# EasyEDA Pro project grandPA2.eprj, schematic matrix
Board Name: matrix; Create Date: 2026-07-15; Page Name: P1; Project Name: grandPA2; Schematic Name: matrix; Update Date: 2026-07-21; Company: EasyEDA.com; Page Size: A4; Version: v0.2
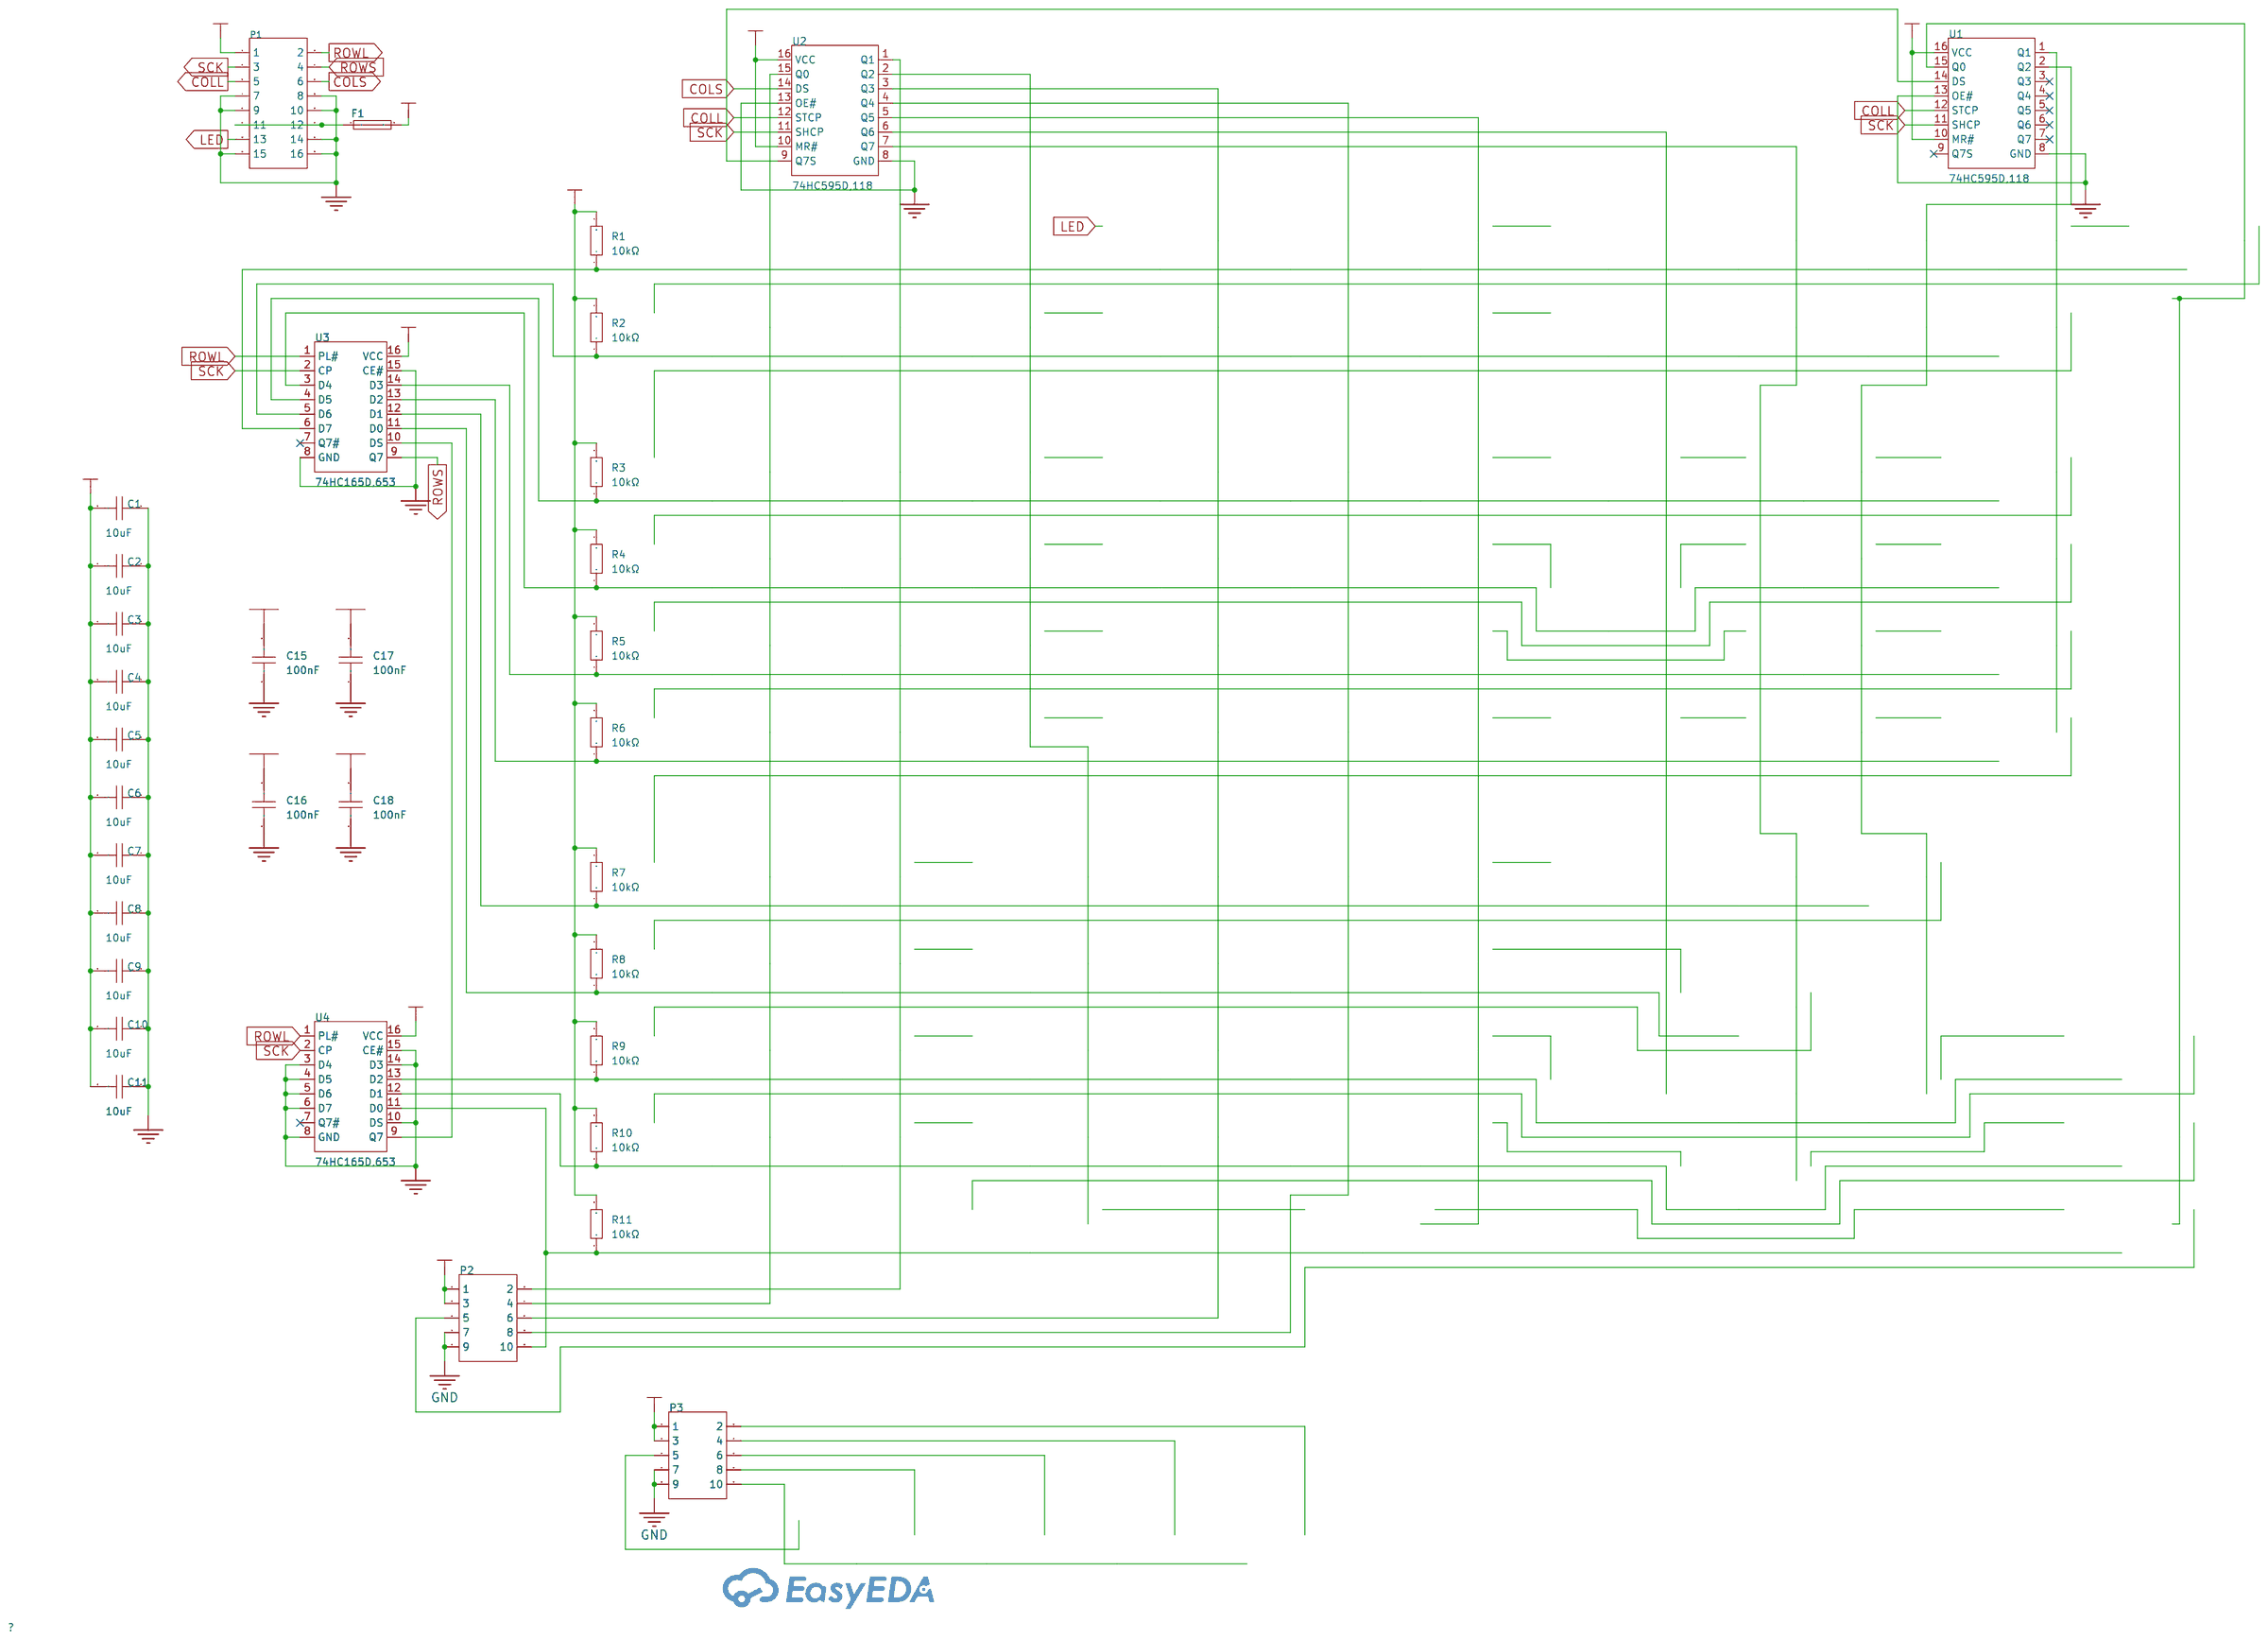
[diagram p0: schematic sheet]

## Parts
C1  10uF  [C0805]
C2  10uF  [C0805]
C3  10uF  [C0805]
C4  10uF  [C0805]
C5  10uF  [C0805]
C6  10uF  [C0805]
C7  10uF  [C0805]
C8  10uF  [C0805]
C9  10uF  [C0805]
C10  10uF  [C0805]
C11  10uF  [C0805]
C15  100nF  [C0402]
C16  100nF  [C0402]
C17  100nF  [C0402]
C18  100nF  [C0402]
CBB1  -
CBB2  -
CBB3  -
CBB4  -
CBB5  -
CBB6  -
CBB7  -
CBB8  -
CBB9  -
CBB10  -
CBB11  -
CBB12  -
CBB13  -
CBB14  -
CBB15  -
CBB16  -
CBB17  -
CBB18  -
CBB19  -
CBB20  -
CBB21  -
CBB22  -
CBB23  -
CBB24  -
CBB25  -
CBB26  -
CBB27  -
CBB28  -
CBB29  -
CBB30  -
CBB31  -
CBB32  -
CBB33  -
CBB34  -
CBB35  -
CBB36  -
CBB37  -
CBB38  -
CBB39  -
CBB40  -
CBB41  -
CBB42  -
CBB43  -
CBB44  -
CBB45  -
CBB46  -
CBB47  -
CBB48  -
CBB49  -
CBB50  -
CBB51  -
CBB52  -
CBB53  -
CBB54  -
CBB55  -
CBB56  -
CBB57  -
CBB58  -
CBB59  -
CBB60  -
CBB61  -
CBB62  -
CBB63  -
CBB64  -
CBB65  -
CBB66  -
CBB67  -
CBB68  -
CBB69  -
CBB70  -
CBB71  -
CBB72  -
CBB73  -
CBB74  -
CBB75  -
CBB76  -
CBB77  -
CBB78  -
CBB79  -
CBB80  -
CBB81  -
CBB82  -
CBB83  -
CBB84  -
CBB85  -
CBB86  -
CBB87  -
F1  1812L150/24MR  [F1812]
KEY1  -
KEY2  -
KEY3  -
KEY4  -
KEY5  -
KEY6  -
KEY7  -
P1  2.54-2*8P简牛  [IDC-TH_16P-P2.54_C3406]
P2  2.54-2*5P简牛  [IDC-TH_10P-P2.54_C5665]
P3  2.54-2*5P简牛  [IDC-TH_10P-P2.54_C5665]
R1  10kΩ  [R0402]
R2  10kΩ  [R0402]
R3  10kΩ  [R0402]
R4  10kΩ  [R0402]
R5  10kΩ  [R0402]
R6  10kΩ  [R0402]
R7  10kΩ  [R0402]
R8  10kΩ  [R0402]
R9  10kΩ  [R0402]
R10  10kΩ  [R0402]
R11  10kΩ  [R0402]
U1  74HC595D,118  [SOIC-16_L9.9-W3.9-P1.27-LS6.0-BL]
U2  74HC595D,118  [SOIC-16_L9.9-W3.9-P1.27-LS6.0-BL]
U3  74HC165D,653  [SOIC-16_L9.9-W3.9-P1.27-LS6.0-BL]
U4  74HC165D,653  [SOIC-16_L9.9-W3.9-P1.27-LS6.0-BL]

## Library data of the parts
C1-C11 = CL21A106KAYNNNE_C15850: LCSC Part Name: 10uF ±10% 25V; Supplier Part: C15850; Manufacturer: SAMSUNG(三星); Manufacturer Part: CL21A106KAYNNNE; Supplier Footprint: 0805; JLCPCB Part Class: Basic Part; Datasheet: https://item.szlcsc.com/datasheet/CL21A106KAYNNNE/16532.html; Supplier: LCSC; Tolerance: ±10%; Voltage Rating: 25V; Temperature Coefficient: X5R
C15-C18 = CL05B104KO5NNNC: LCSC Part Name: 100nF ±10% 16V; Supplier Part: C1525; Manufacturer: SAMSUNG(三星); Supplier Footprint: 0402; JLCPCB Part Class: Basic Part; Datasheet: https://item.szlcsc.com/datasheet/CL05B104KO5NNNC/1877.html; Supplier: LCSC; Tolerance: ±10%; Voltage Rating: 16V; Temperature Coefficient: X7R
F1 = 1812L150/24MR: LCSC Part Name: 24V 1.5A 1812自恢复; Supplier Part: C142805; Manufacturer: Littelfuse(美国力特); Supplier Footprint: 1812; JLCPCB Part Class: Extended Part; Datasheet: https://item.szlcsc.com/datasheet/1812L150%252F24MR/154136.html; Supplier: LCSC; Voltage - Max: 24V; Current - Max: 20A; Hold Current: 1.5A; Trip Current: 3A; Power Dissipation: 800mW; Resistance - Initial (Ri) (Min): 40mΩ; Resistance - Post Trip (R1) (Max): 120mΩ; Time to Trip(Max): 1.5s; Operating Temperature: -40℃~+85℃; Length: 4.73mm; Width: 3.41mm; Height: 1.8mm
P1 = 2.54-2*8P简牛: LCSC Part Name: 2.54mm 2x8P 排数:2 每排P数:8; Supplier Part: C3406; Manufacturer: BOOMELE(博穆精密); Supplier Footprint: 插件,P=2.54mm; JLCPCB Part Class: Extended Part; Datasheet: https://item.szlcsc.com/datasheet/2.54-2*8P%25E7%25AE%2580%25E7%2589%259B/3807.html; Supplier: LCSC; Connector Type: IDC Header; Pitch: 2.54mm; Number of Positions or Pins: 2x8P; Current Rating: 1A; Holder Type: Through Hole; Row Spacing: 2.54mm; Number of Rows: 2; Number of PINs Per Row: 8; Contact Material: Brass; Contact Plating: Gold; Operating Temperature: -55℃~+105℃; Color: Black
P2 P3 = 2.54-2*5P简牛: LCSC Part Name: 2.54mm 2x5P 排数:2 每排P数:5; Supplier Part: C5665; Manufacturer: BOOMELE(博穆精密); Supplier Footprint: 插件,P=2.54mm; JLCPCB Part Class: Extended Part; Supplier: LCSC; Connector Type: IDC Header; Pitch: 2.54mm; Number of Positions or Pins: 2x5P; Current Rating: 1A; Holder Type: Through Hole; Row Spacing: 2.54mm; Number of Rows: 2; Number of PINs Per Row: 5; Contact Material: Brass; Contact Plating: Gold; Operating Temperature: -55℃~+105℃; Color: Black
R1-R11 = 0402WGF1002TCE: Type:Thick Film Resistor Resistance:10kΩ Tolerance:±1% Tolerance:±1% Power(Watts):62.5mW Voltage-Supply(Max):50V Temperature Coefficient:±100ppm/℃ Temperature Coefficient:±100ppm/℃ Operating Temperature:-55℃~+155℃ Operating Temperature:-55℃~+155℃; LCSC Part Name: 10kΩ ±1% 62.5mW 厚膜电阻; Supplier Part: C25744; Manufacturer: UNI-ROYAL(厚声); Supplier Footprint: 0402; JLCPCB Part Class: Basic Part; Datasheet: https://item.szlcsc.com/datasheet/0402WGF1002TCE/26487.html; Supplier: LCSC; Type: Thick Film Resistor; Tolerance: ±1%; Power(Watts): 62.5mW; Voltage-Supply(Max): 50V; Temperature Coefficient: ±100ppm/℃; Operating Temperature: -55℃~+155℃
U1 U2 = 74HC595D,118: LCSC Part Name: 三态输出 串行至串行或并行移位寄存器; Supplier Part: C5947; Manufacturer: Nexperia(安世); Supplier Footprint: SOIC-16; JLCPCB Part Class: Basic Part; Datasheet: https://item.szlcsc.com/datasheet/74HC595D%252C118/6413.html; Supplier: LCSC; Function: Serial-to-Serial or Parallel; Voltage - Supply: 2V~6V; Clock Frequency: 100MHz; Number of Elements: 1; Number of Bits per Element: 8; Output Type: Tri-State; Series: 74HC; Operating Temperature: -40℃~+125℃; Propagation Delay: 19ns@4.5V,50pF; Features: Asynchronous clear function；Output enable
U3 U4 = 74HC165D,653: LCSC Part Name: 补充型输出 并行或串行至串行移位寄存器; Supplier Part: C5613; Manufacturer: Nexperia(安世); Supplier Footprint: SOIC-16; JLCPCB Part Class: Extended Part; Datasheet: https://item.szlcsc.com/datasheet/74HC165D%252C653/6064.html; Supplier: LCSC; Function: Parallel or Serial to Serial; Voltage - Supply: 2V~6V; Clock Frequency: 35MHz; Number of Elements: 1; Number of Bits per Element: 8; Output Type: Complementary type; Series: 74HC; Operating Temperature: -40℃~+125℃; Pd - Power Dissipation: 500mW; Propagation Delay: 28ns@6V,50pF; Output Current: 25mA; Features: Asynchronous parallel load function

## Nets
3V3: C15.2 C16.2 C17.2 C18.2 P1.1 R1.2 R2.2 R3.2 R4.2 R5.2 R6.2 R7.2 R8.2 R9.2 R10.2 R11.2 U1.10(MR#) U1.16(VCC) U2.10(MR#) U2.16(VCC) U3.16(VCC) U4.16(VCC)
5V: C1.2 C2.2 C3.1 C4.2 C5.2 C6.2 C7.2 C8.2 C9.2 C10.2 C11.2 F1.2 P2.1 P2.3 P3.1 P3.3
GND: C1.1 C2.1 C3.2 C4.1 C5.1 C6.1 C7.1 C8.1 C9.1 C10.1 C11.1 C15.1 C16.1 C17.1 C18.1 P1.7 P1.8 P1.9 P1.10 P1.14 P1.15 P1.16 P2.7 P2.9 P3.7 P3.9 U1.8(GND) U1.13(OE#) U2.8(GND) U2.13(OE#) U3.8(GND) U3.15(CE#) U4.3(D4) U4.4(D5) U4.5(D6) U4.6(D7) U4.8(GND) U4.10(DS) U4.14(D3) U4.15(CE#)
COLL: P1.5 U1.12(STCP) U2.12(STCP)
COLS: P1.6 U2.14(DS)
LED: CBB1.(DO) CBB2.(DO) CBB3.(DO) CBB4.(DO) CBB5.(DO) CBB6.(DO) CBB7.(DO) CBB8.(DO) CBB9.(DO) CBB10.(DO) CBB11.(DO) CBB12.(DO) CBB13.(DO) CBB14.(DO) CBB15.(DO) CBB16.(DO) CBB17.(DO) CBB18.(DO) CBB19.(DO) CBB20.(DO) CBB21.(DO) CBB22.(DO) CBB23.(DO) CBB24.(DO) CBB25.(DO) CBB26.(DO) CBB27.(DO) CBB28.(DO) CBB29.(DO) CBB30.(DO) CBB31.(DO) CBB32.(DO) CBB33.(DO) CBB34.(DO) CBB35.(DO) CBB36.(DO) CBB37.(DO) CBB38.(DO) CBB39.(DO) CBB40.(DO) CBB41.(DO) CBB42.(DO) CBB43.(DO) CBB44.(DO) CBB45.(DO) CBB46.(DO) CBB47.(DO) CBB48.(DO) CBB49.(DO) CBB50.(DO) CBB51.(DO) CBB52.(DO) CBB53.(DO) CBB54.(DO) CBB55.(DO) CBB56.(DO) CBB57.(DO) CBB58.(DO) CBB59.(DO) CBB60.(DO) CBB61.(DO) CBB62.(DO) CBB63.(DO) CBB64.(DO) CBB65.(DO) CBB66.(DO) CBB67.(DO) CBB68.(DO) CBB69.(DO) CBB70.(DO) CBB71.(DO) CBB72.(DO) CBB73.(DO) CBB74.(DO) CBB75.(DO) CBB76.(DO) CBB77.(DO) CBB78.(DO) CBB79.(DO) CBB84.(DO) CBB85.(DO) CBB86.(DO) CBB87.(DO) KEY1.(DO) KEY2.(DO) KEY3.(DO) KEY4.(DO) KEY5.(DO) KEY6.(DO) KEY7.(DO) P1.13 P2.2 P2.4 P2.5 P2.6 P2.8 P2.10 R1.1 R2.1 R3.1 R4.1 R5.1 R6.1 R7.1 R8.1 R9.1 R10.1 R11.1 U1.1(Q1) U1.2(Q2) U1.15(Q0) U2.1(Q1) U2.2(Q2) U2.3(Q3) U2.4(Q4) U2.5(Q5) U2.6(Q6) U2.7(Q7) U2.15(Q0) U3.3(D4) U3.4(D5) U3.5(D6) U3.6(D7) U3.11(D0) U3.12(D1) U3.13(D2) U3.14(D3) U4.11(D0) U4.12(D1) U4.13(D2)
ROWL: P1.2 U3.1(PL#) U4.1(PL#)
ROWS: P1.4 U3.9(Q7)
SCK: P1.3 U1.11(SHCP) U2.11(SHCP) U3.2(CP) U4.2(CP)
$1N16554: F1.1 P1.11 P1.12
$1N17492: U1.14(DS) U2.9(Q7S)
$1N28901: U3.10(DS) U4.9(Q7)
Net-(CBB80-): CBB80.(DO) CBB81.(DO) CBB82.(DO) CBB83.(DO) P3.2 P3.4 P3.5 P3.6 P3.8 P3.10

Not connected (* = marked no-connect by the designer): U1 3(Q3)* 4(Q4)* 5(Q5)* 6(Q6)* 7(Q7)* 9(Q7S)*; U3 7(Q7#)*; U4 7(Q7#)*
